# EAGLE schematic CNC-64 IO PCB 2 (EAGLE 9.2.2)
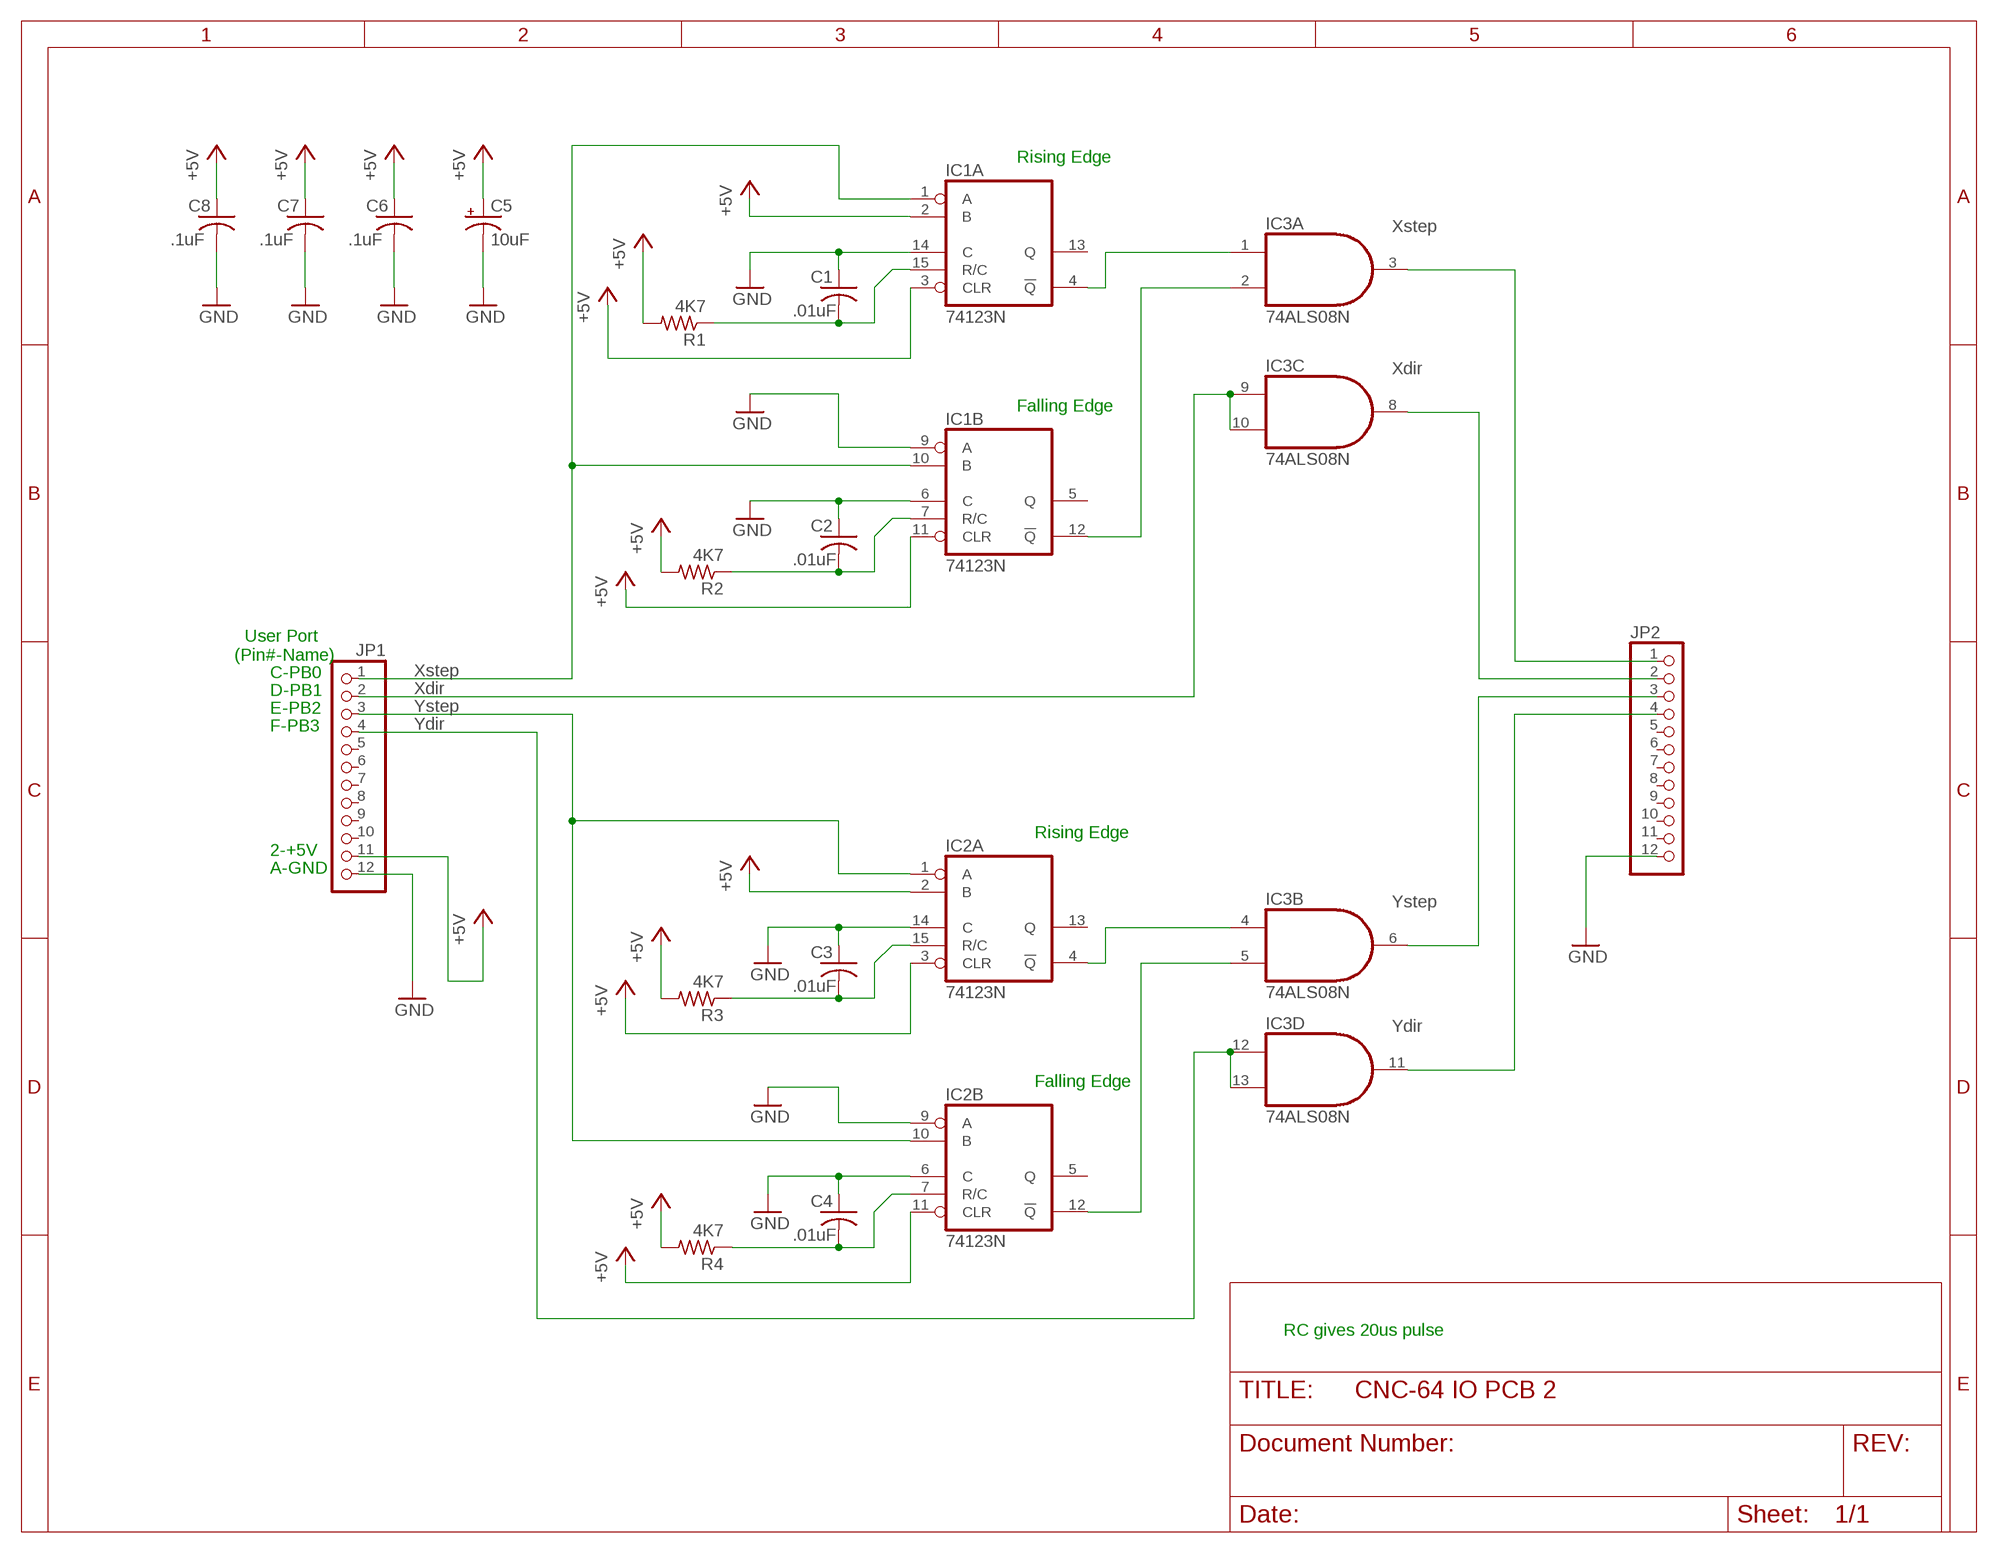
[diagram p0: schematic, sheet 1]

## Parts
C1  .01uF  C-US050-030X075  [C050-030X075]
C2  .01uF  C-US050-030X075  [C050-030X075]
C3  .01uF  C-US050-030X075  [C050-030X075]
C4  .01uF  C-US050-030X075  [C050-030X075]
C5  10uF  CPOL-USE2.5-5  [E2,5-5]
C6  .1uF  C-US050-030X075  [C050-030X075]
C7  .1uF  C-US050-030X075  [C050-030X075]
C8  .1uF  C-US050-030X075  [C050-030X075]
IC1  74123N  [DIL16]
IC2  74123N  [DIL16]
IC3  74ALS08N  [DIL14]
JP1  PINHD-1X12  [1X12]
JP2  PINHD-1X12  [1X12]
R1  4K7  R-US_0207/10  [0207/10]
R2  4K7  R-US_0207/10  [0207/10]
R3  4K7  R-US_0207/10  [0207/10]
R4  4K7  R-US_0207/10  [0207/10]

## Nets
+5V: C5.+ C6.1 C7.1 C8.1 IC1.2(A:B) IC1.3(A:CLR) IC1.11(B:CLR) IC2.2(A:B) IC2.3(A:CLR) IC2.11(B:CLR) JP1.11 R1.2 R2.2 R3.2 R4.2
GND: C1.1 C2.1 C3.1 C4.1 C5.- C6.2 C7.2 C8.2 IC1.6(B:C) IC1.9(B:A) IC1.14(A:C) IC2.6(B:C) IC2.9(B:A) IC2.14(A:C) JP1.12 JP2.12
N$1: C1.2 IC1.15(A:R/C) R1.1
N$2: IC1.4(A:!Q) IC3.1(A:I0)
N$3: IC1.1(A:A) IC1.10(B:B) JP1.1
N$4: C3.2 IC2.15(A:R/C) R3.1
N$5: C2.2 IC1.7(B:R/C) R2.1
N$6: IC2.4(A:!Q) IC3.4(B:I0)
N$7: IC1.12(B:!Q) IC3.2(A:I1)
N$10: IC2.1(A:A) IC2.10(B:B) JP1.3
N$11: IC3.9(C:I0) IC3.10(C:I1) JP1.2
N$12: IC3.12(D:I0) IC3.13(D:I1) JP1.4
N$13: C4.2 IC2.7(B:R/C) R4.1
N$14: IC3.3(A:O) JP2.1
N$15: IC3.6(B:O) JP2.3
N$17: IC2.12(B:!Q) IC3.5(B:I1)
N$19: IC3.11(D:O) JP2.4
N$20: IC3.8(C:O) JP2.2
Unconnected: IC1.5(B:Q) IC1.13(A:Q) IC2.5(B:Q) IC2.13(A:Q) JP1.5 JP1.6 JP1.7 JP1.8 JP1.9 JP1.10 JP2.5 JP2.6 JP2.7 JP2.8 JP2.9 JP2.10 JP2.11

## Notes on the sheet
- Rising Edge
- Xstep
- Xdir
- Falling Edge
- User Port 
  (Pin#-Name)
- C-PB0 | Xstep
- D-PB1 | Xdir
- E-PB2 | Ystep
- F-PB3 | Ydir
- Rising Edge
- 2-+5V
- A-GND
- Ystep
- Ydir
- Falling Edge
- RC gives 20us pulse

## Power pins joined to a net without a drawn wire
GND: IC1.8(P:GND) IC2.8(P:GND) IC3.7(P:GND)
VCC: IC1.16(P:VCC) IC2.16(P:VCC) IC3.14(P:VCC)

## Library data of the parts
C1-C4 C6-C8 = rcl:C-US: CAPACITOR, American symbol; SPICEPREFIX: C
C5 = rcl:CPOL-US: POLARIZED CAPACITOR, American symbol; SPICEPREFIX: C
IC1 IC2 = 74xx-us:74*123: Retriggerable monostable MULTIVIBRATOR
IC3 = 74xx-us:74*08: Quad 2-input AND gate
JP1 JP2 = pinhead:PINHD-1X12: PIN HEADER
R1-R4 = rcl:R-US_: RESISTOR, American symbol; SPICEPREFIX: R